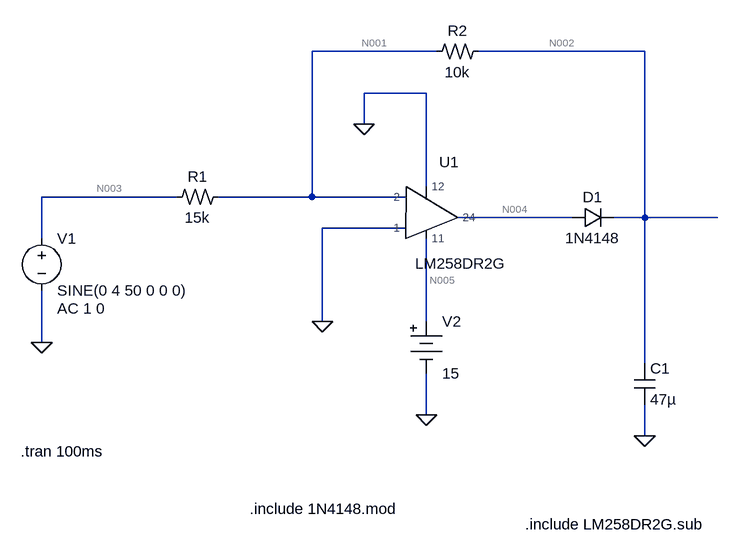
[diagram p0: schematic 4AC to 3.3DC third version.asc]
4AC to 3.3DC third version.asc, the LTspice schematic file:
Version 4
SHEET 1 1108 680
WIRE 656 -128 464 -128
WIRE 976 -128 720 -128
WIRE 640 -64 544 -64
WIRE 544 -16 544 -64
WIRE 640 80 640 -64
WIRE 256 96 48 96
WIRE 464 96 464 -128
WIRE 464 96 320 96
WIRE 608 96 464 96
WIRE 864 128 688 128
WIRE 976 128 976 -128
WIRE 976 128 928 128
WIRE 1088 128 976 128
WIRE 608 144 480 144
WIRE 48 160 48 96
WIRE 480 288 480 144
WIRE 640 288 640 160
WIRE 48 320 48 240
WIRE 976 352 976 128
WIRE 640 432 640 368
WIRE 976 464 976 416
FLAG 48 320 0
FLAG 480 288 0
FLAG 640 432 0
FLAG 544 -16 0
FLAG 976 464 0
SYMBOL voltage 48 144 R0
WINDOW 123 24 124 Left 2
WINDOW 39 0 0 Left 0
SYMATTR Value2 AC 1 0
SYMATTR InstName V1
SYMATTR Value SINE(0 4 50 0 0 0)
SYMBOL res2 320 80 R90
WINDOW 0 0 32 VBottom 2
WINDOW 3 32 32 VTop 2
SYMATTR InstName R1
SYMATTR Value 15k
SYMBOL res2 720 -144 R90
WINDOW 0 0 32 VBottom 2
WINDOW 3 32 32 VTop 2
SYMATTR InstName R2
SYMATTR Value 10k
SYMBOL cap 960 352 R0
SYMATTR InstName C1
SYMATTR Value 47µ
SYMBOL Misc\\battery 640 272 R0
WINDOW 123 0 0 Left 0
WINDOW 39 0 0 Left 0
SYMATTR InstName V2
SYMATTR Value 15
SYMBOL diode 864 144 R270
WINDOW 0 32 32 VTop 2
WINDOW 3 0 32 VBottom 2
SYMATTR InstName D1
SYMATTR Value 1N4148
SYMBOL LM258DR2G 464 128 R0
SYMATTR InstName U1
TEXT 16 488 Left 2 !.tran 100ms
TEXT 368 576 Left 2 !.include 1N4148.mod
TEXT 792 600 Left 2 !.include LM258DR2G.sub

The netlist it stands for:
* 4AC to 3.3DC third version.asc
V1 N003 0 SINE(0 4 50 0 0 0) AC 1 0
R1 N001 N003 15k
R2 N002 N001 10k
C1 N002 0 47µ
V2 N005 0 15
D1 N004 N002 1N4148
XU1 0 N001 N005 0 N004 LM258DR2G  ; pins 1 2 11 12 24
.model D D
.lib standard.dio
.tran 100ms
.include 1N4148.mod
.include LM258DR2G.sub
.lib H:\D5\Interface\Ltspice Model\LM258DR2G.sub
.backanno
.end

* Results of the author's LTspice run, read from the files saved beside the schematic
* Operating Point, zero values left out:
*   V(n001) = 629.8 µV
*   V(n002) = 629.8 µV
*   V(n005) = 15 V
*   V(n004) = 41.57 mV
*   I(R1) = 41.99 nA
*   I(V2) = 628 µA
*   I(V1) = 41.99 nA
*   Ix(u1:1) = -46.73 nA
*   Ix(u1:2) = -41.99 nA
*   Ix(u1:11) = -628 µA
*   Ix(u1:12) = -1.142 mA
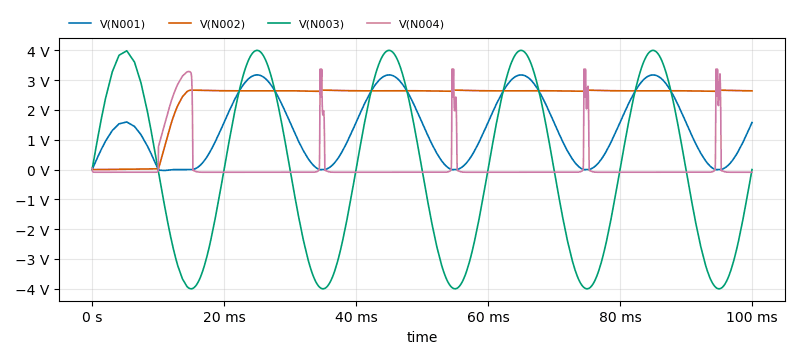
[diagram p1: Transient Analysis of 4AC to 3.3DC third version.asc, plotted from the saved traces]
* Transient Analysis, 1 run:
*   V(N001): min -28.02 mV, max 3.176 V, average 1.395 V, rms 1.782 V, last 1.581 V
*   V(N002): min 629.8 µV, max 2.667 V, average 2.333 V, rms 2.474 V, last 2.642 V
*   V(N003): min -4 V, max 4 V, average -1.049 mV, rms 2.83 V, last 0 V
*   V(N004): min -88.94 mV, max 3.377 V, average 126.6 mV, rms 741.9 mV, last -88.82 mV